# EAGLE design Order#100022604_2Layer_Green_1.6mm_HASL_5cm_x_5cm (EAGLE 6.3)
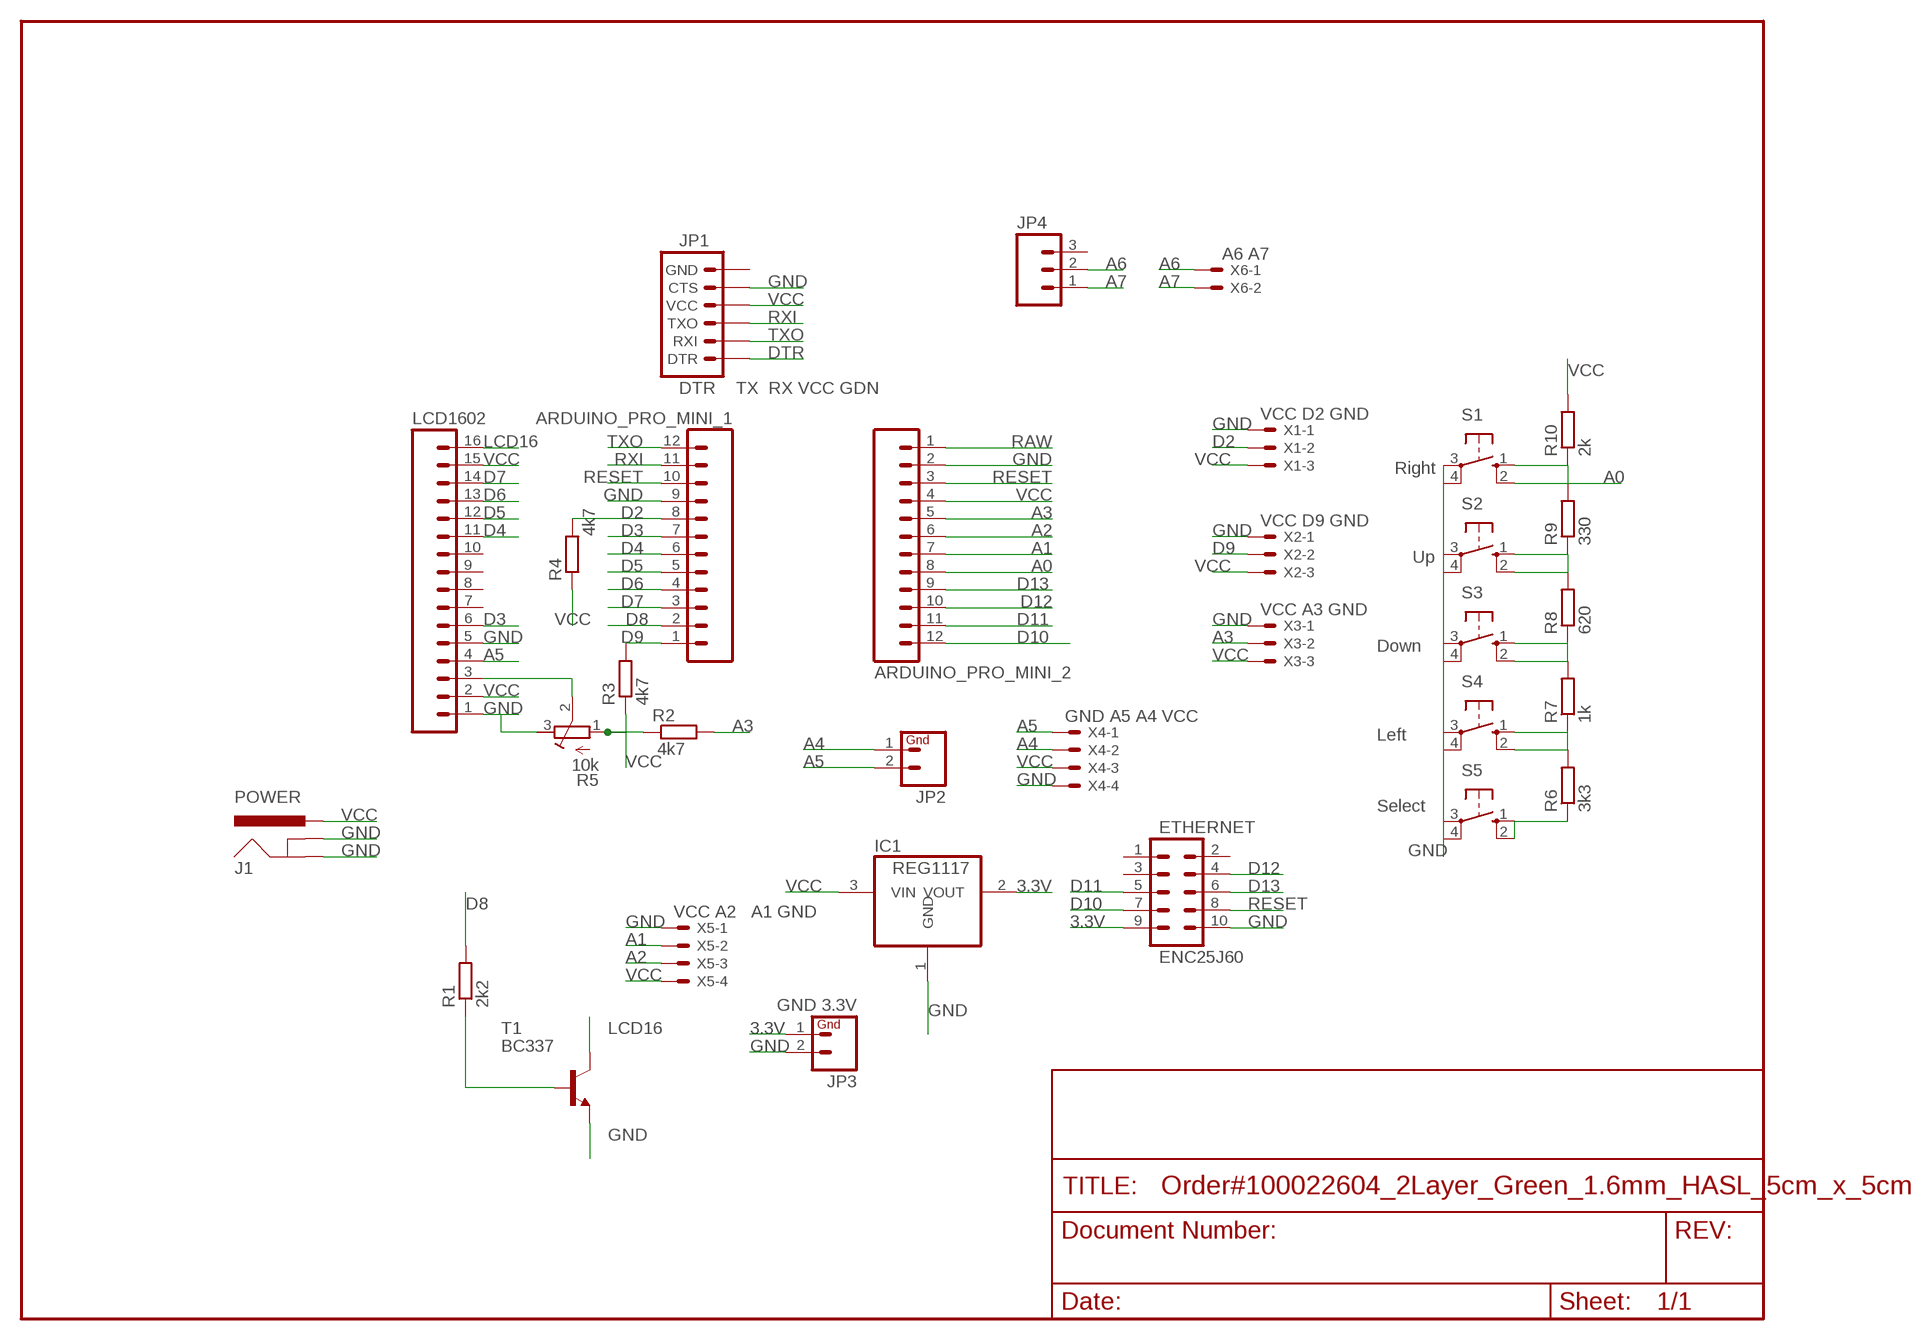
[diagram p0: schematic, sheet 1]

## Parts
ARDUINO_PRO_MINI_1  M12PTH  [1X12]
ARDUINO_PRO_MINI_2  M12PTH  [1X12]
ETHERNET  ENC25J60  M05X2PTH  [AVR_ICSP]
IC1  REG1117  [SOT223]
J1  POWER  POWER_JACKPTH_LOCK  [POWER_JACK_PTH_LOCK]
JP1  DTR TX RX VCC GDN  ARDUINO_SERIAL_PROGRAMPTH  [1X06]
JP2  M02PTH  [1X02]
JP3  GND 3.3V  M02PTH  [1X02]
JP4  M03PTH  [1X03]
LCD1602  HEADER-16P-2.54  [16P-2.54]
R1  2k2  R-EU_0207/10  [0207/10]
R2  4k7  R-EU_0207/10  [0207/10]
R3  4k7  R-EU_0207/10  [0207/10]
R4  4k7  R-EU_0207/10  [0207/10]
R5  10k  R-TRIMM64W  [RTRIM64W]
R6  3k3  R-EU_0207/10  [0207/10]
R7  1k  R-EU_0207/10  [0207/10]
R8  620  R-EU_0207/10  [0207/10]
R9  330  R-EU_0207/10  [0207/10]
R10  2k  R-EU_0207/10  [0207/10]
S1  Right  10-XX  [B3F-10XX]
S2  Up  10-XX  [B3F-10XX]
S3  Down  10-XX  [B3F-10XX]
S4  Left  10-XX  [B3F-10XX]
S5  Select  10-XX  [B3F-10XX]
T1  BC337  [TO92]
X1  VCC D2 GND  22-23-2031  [22-23-2031]
X2  VCC D9 GND  22-23-2031  [22-23-2031]
X3  VCC A3 GND  22-23-2031  [22-23-2031]
X4  GND A5 A4 VCC  22-23-2041  [22-23-2041]
X5  VCC A2 A1 GND  22-23-2041  [22-23-2041]
X6  A6 A7  22-23-2021  [22-23-2021]

## Nets
3.3V: ETHERNET.9 IC1.2(VOUT) JP3.1
A0: ARDUINO_PRO_MINI_2.8 R9.2 R10.1 S1.1(S) S1.2(S1)
A1: ARDUINO_PRO_MINI_2.7 X5.2
A2: ARDUINO_PRO_MINI_2.6 X5.3
A3: ARDUINO_PRO_MINI_2.5 R2.2 X3.2
A4: JP2.1 X4.2
A5: JP2.2 LCD1602.4 X4.1
A6: JP4.2 X6.1
A7: JP4.1 X6.2
D2: ARDUINO_PRO_MINI_1.8 R4.2 X1.2
D3: ARDUINO_PRO_MINI_1.7 LCD1602.6
D4: ARDUINO_PRO_MINI_1.6 LCD1602.11
D5: ARDUINO_PRO_MINI_1.5 LCD1602.12
D6: ARDUINO_PRO_MINI_1.4 LCD1602.13
D7: ARDUINO_PRO_MINI_1.3 LCD1602.14
D8: ARDUINO_PRO_MINI_1.2 R1.2
D9: ARDUINO_PRO_MINI_1.1 R3.2 X2.2
D10: ARDUINO_PRO_MINI_2.12 ETHERNET.7
D11: ARDUINO_PRO_MINI_2.11 ETHERNET.5
D12: ARDUINO_PRO_MINI_2.10 ETHERNET.4
D13: ARDUINO_PRO_MINI_2.9 ETHERNET.6
DTR: JP1.1(DTR)
GND [vcc]: ARDUINO_PRO_MINI_1.9 ARDUINO_PRO_MINI_2.2 ETHERNET.10 IC1.1(GND) J1.GND J1.GNDBREAK JP1.5(CTS) JP3.2 LCD1602.1 LCD1602.5 R5.3(A) S1.3(P) S1.4(P1) S2.3(P) S2.4(P1) S3.3(P) S3.4(P1) S4.3(P) S4.4(P1) S5.3(P) S5.4(P1) T1.1(E) X1.1 X2.1 X3.1 X4.4 X5.1
LCD16: LCD1602.16 T1.3(C)
N$1: LCD1602.3 R5.2(S)
N$4: R1.1 T1.2(B)
N$5: R6.1 S5.1(S) S5.2(S1)
N$6: R6.2 R7.1 S4.1(S) S4.2(S1)
N$8: R7.2 R8.1 S3.1(S) S3.2(S1)
N$11: R8.2 R9.1 S2.1(S) S2.2(S1)
RAW [vcc]: ARDUINO_PRO_MINI_2.1
RESET: ARDUINO_PRO_MINI_1.10 ARDUINO_PRO_MINI_2.3 ETHERNET.8
RXI: ARDUINO_PRO_MINI_1.11 JP1.3(TXO)
TXO: ARDUINO_PRO_MINI_1.12 JP1.2(RXI)
VCC: ARDUINO_PRO_MINI_2.4 IC1.3(VIN) J1.PWR JP1.4(VCC) LCD1602.2 LCD1602.15 R2.1 R3.1 R4.1 R5.1(E) R10.2 X1.3 X2.3 X3.3 X4.3 X5.4
Unconnected: ETHERNET.1 ETHERNET.2 ETHERNET.3 JP1.6(GND) JP4.3 LCD1602.7 LCD1602.8 LCD1602.9 LCD1602.10

## Library data of the parts
ARDUINO_PRO_MINI_1 ARDUINO_PRO_MINI_2 = SparkFun:M12: Header 12 Standard 12-pin 0.1" header. Use with straight break away headers (SKU : PRT-00116), right angle break away headers (PRT-00553), swiss pins (PRT-00743), machine pins (PRT-00117), and female headers (PRT-00115).
ETHERNET = SparkFun-Connectors:M05X2: Header 5x2 Standard 10-pin dual row 0.1" header. Commonly used with AVR-ISP. Use with Spark Fun Electronics SKU: PRT-00778
IC1 = burr-brown:REG1117: 800mA and 1A Low Dropout (LDO) Positive Regulator 1.8V, 2.5V, 2.85V, 3.3V, 5V, and Adj; MPN: REG1117; OC_FARNELL: 1097566; OC_NEWARK: 14P6981
J1 = SparkFun-Connectors:POWER_JACK: Power Jack This is the standard 5.5mm barrel jack for power. The PTH is the most common, proven, reliable, footprint. The Slot footprint only works if the mill layer is transmitted to the PCB fab house so be warned. Spark Fun Electronics SKU : PRT-00119 SMT: CONN-08106 Mating wall wart : TOL-00298 (and others)
JP1 = SparkFun:ARDUINO_SERIAL_PROGRAM
JP2 JP3 = SparkFun:M02: Header 2 Standard 2-pin 0.1" header. Use with straight break away headers (SKU : PRT-00116), right angle break away headers (PRT-00553), swiss pins (PRT-00743), machine pins (PRT-00117), and female headers (PRT-00115). Molex polarized connector foot print use with SKU : PRT-08233 with associated crimp pins and housings.
JP4 = SparkFun-Connectors:M03: Header 3 Standard 3-pin 0.1" header. Use with straight break away headers (SKU : PRT-00116), right angle break away headers (PRT-00553), swiss pins (PRT-00743), machine pins (PRT-00117), and female headers (PRT-00115). Molex polarized connector foot print use with SKU : PRT-08232 with associated crimp pins and housings.
LCD1602 = Connector_seedstudio:HEADER-16P
R1-R4 R6-R10 = resistor:R-EU_: RESISTOR, European symbol
R5 = resistor:R-TRIMM: Trimm resistor
S1-S5 = switch-omron:10-XX: OMRON SWITCH; MPN: B3F-1000; OC_FARNELL: 176432; OC_NEWARK: 36M3542
T1 = transistor:BC337: NPN TRANSISTOR
X1-X3 = con-molex:22-23-2031: .100" (2.54mm) Center Header - 3 Pin; MF: MOLEX; MPN: 22-23-2031; OC_FARNELL: 1462950; OC_NEWARK: 30C0862
X4 X5 = con-molex:22-23-2041: .100" (2.54mm) Center Header - 4 Pin; MF: MOLEX; MPN: 22-23-2041; OC_FARNELL: 1462920; OC_NEWARK: 38C0355
X6 = con-molex:22-23-2021: .100" (2.54mm) Center Header - 2 Pin; MF: MOLEX; MPN: 22-23-2021; OC_FARNELL: 1462926; OC_NEWARK: 25C3832

## Net classes
0 default: width 0.203 mm
1 vcc: width 0.254 mm

## Board
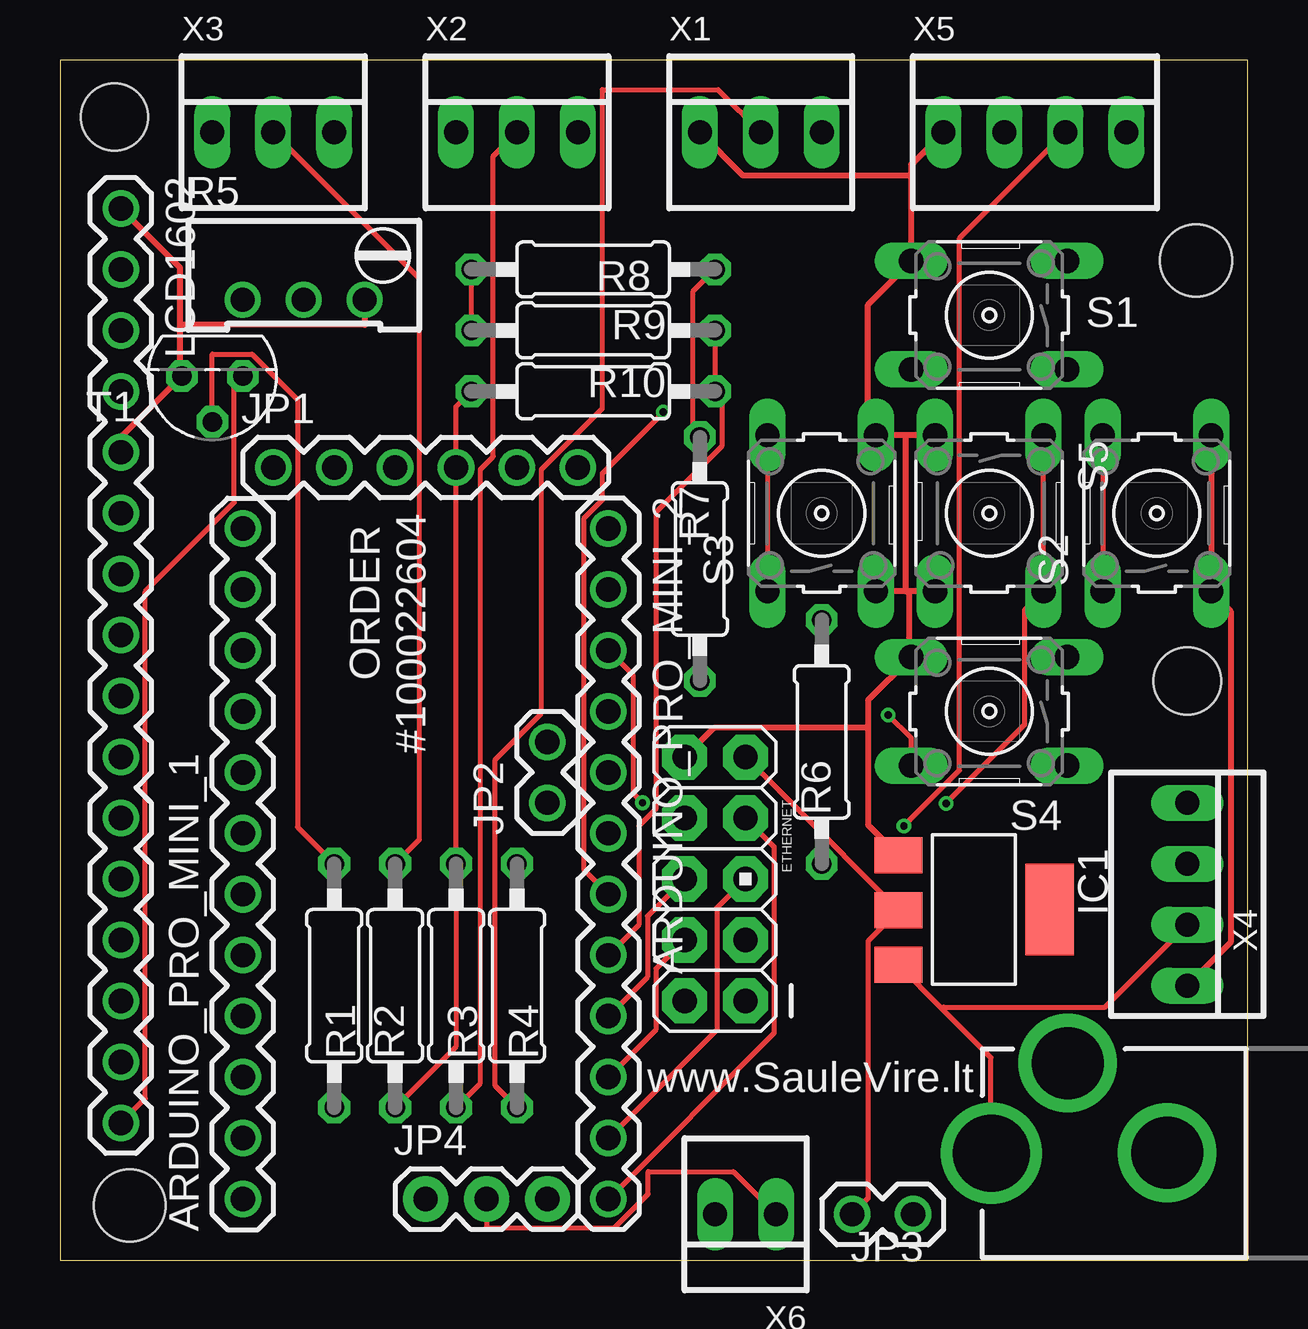
[diagram p1: board, top side]
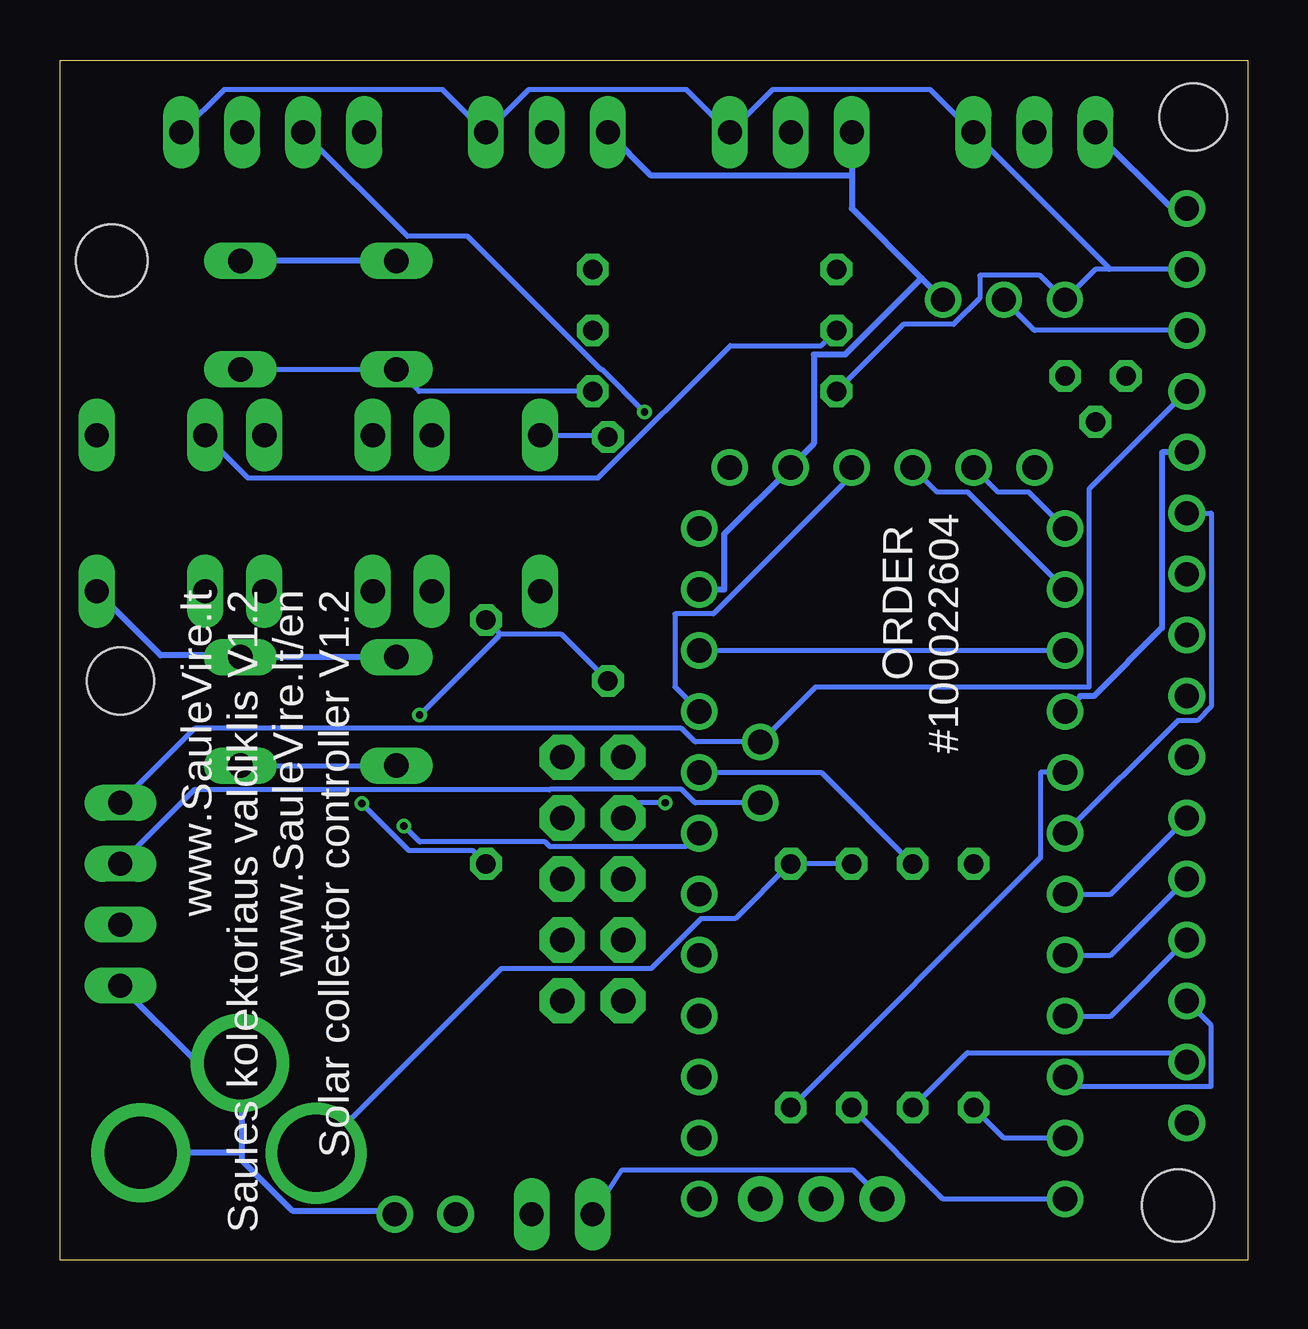
[diagram p2: board, bottom side, seen from below]

Size 49.51 x 50 mm. Coordinates in mm from the lower left corner, seen from the top.
Outline: 0,0 49.51,0 49.51,50 0,50 0,0
Copper layers (1*16): Top 0.035mm / dielectric 1.5mm / Bottom 0.035mm
Design rules "ITEADstudio_DRC": minimum track width 6mil, minimum drill 12mil, track to track 6mil, track to pad 6mil, pad to pad 6mil, via to via 6mil, smd to smd 0mil, copper to edge 10mil, drill to drill 10mil, minimum pad ring 10mil, minimum via ring 6mil, stop-mask expansion 2mil, vias tented up to drill 100mil, thermal gap 10mil
Holes 3 mm at 2.9,2.27 47.35,41.64
Holes 2.8 mm at 2.27,47.62 46.99,24.13

### Footprints (pad centres in the part's own frame; a part is rotated, then mirrored left to right if it is on the bottom)
1X12 = drill 1.016: 1 0,0; 2 2.54,0; 3 5.08,0; 4 7.62,0; 5 10.16,0; 6 12.7,0; 7 15.24,0; 8 17.78,0; 9 20.32,0; 10 22.86,0; 11 25.4,0; 12 27.94,0
AVR_ICSP = drill 1.016 pad 1.88 octagon: 1 -1.27,5.08; 2 1.27,5.08; 3 -1.27,2.54; 4 1.27,2.54; 5 -1.27,0; 6 1.27,0; 7 -1.27,-2.54; 8 1.27,-2.54; 9 -1.27,-5.08; 10 1.27,-5.08
SOT223 = smd 1.499 x 2.007: 1 -2.261,-3.15; 2 0.025,-3.15; 3 2.311,-3.15 | smd 3.81 x 2.007: 4 0,3.15
POWER_JACK_PTH_LOCK = drill 2.997 pad 4.115: GND 0.025,6.557; GNDBREAK 3.762,10.7 | drill 3.2 pad 4.115: PWR 0,13.878
1X06 = drill 1.016: 1 0,0; 2 2.54,0; 3 5.08,0; 4 7.62,0; 5 10.16,0; 6 12.7,0
1X02 = drill 1.016: 1 0,0; 2 2.54,0
1X03 = drill 1.016 pad 1.88: 1 0,0; 2 2.54,0; 3 5.08,0
16P-2.54 = drill 1.016: 1 0,0; 2 2.54,0; 3 5.08,0; 4 7.62,0; 5 10.16,0; 6 12.7,0; 7 15.24,0; 8 17.78,0; 9 20.32,0; 10 22.86,0; 11 25.4,0; 12 27.94,0; 13 30.48,0; 14 33.02,0; 15 35.56,0; 16 38.1,0
0207/10 = drill 0.813 octagon: 1 -5.08,0; 2 5.08,0
RTRIM64W = drill 1: 1 1.27,-2.54; 2 1.27,0; 3 1.27,2.54
B3F-10XX = drill 1.016 long: 1 -3.251,2.261; 2 3.251,2.261; 3 -3.251,-2.261; 4 3.251,-2.261
TO92 = drill 0.813 octagon: 1 1.27,0; 2 0,1.905; 3 -1.27,0
22-23-2031 = drill 1 long: 1 -2.54,0; 2 0,0; 3 2.54,0
22-23-2041 = drill 1 long: 1 -3.81,0; 2 -1.27,0; 3 1.27,0; 4 3.81,0
22-23-2021 = drill 1 long: 1 -1.27,0; 2 1.27,0

### Placement (x,y rotation side)
ARDUINO_PRO_MINI_1  7.62,2.54 90 top
ARDUINO_PRO_MINI_2  22.86,30.48 270 top
ETHERNET  27.3,15.88 180 top
IC1  38.1,14.61 270 top
J1  52.7,4.45 90 top
JP1  8.89,33.02 0 top
JP2  20.32,19.05 90 top
JP3  33.02,1.91 0 top
JP4  15.24,2.54 0 top
LCD1602  2.54,43.81 270 top
R1  11.43,11.43 270 top
R2  13.97,11.43 90 top
R3  16.51,11.43 270 top
R4  19.05,11.43 270 top
R5  10.16,41.27 270 top
R6  31.75,21.59 90 top
R7  26.67,29.21 90 top
R8  22.23,41.27 180 top
R9  22.23,38.73 0 top
R10  22.23,36.2 180 top
S1  38.73,39.37 180 top
S2  45.72,31.11 90 top
S3  31.75,31.11 90 top
S4  38.73,22.86 180 top
S5  38.73,31.11 270 top
T1  6.35,36.83 180 top
X1  29.21,46.99 0 top
X2  19.05,46.99 0 top
X3  8.89,46.99 0 top
X4  46.99,15.24 270 top
X5  40.64,46.99 0 top
X6  28.57,1.91 180 top

### Tracks (layer width: path | path; a pad name or v marks a point on that pad's centre or on a via)
3.3V
  Top 0.203: ETHERNET.9 28.6,20.95 32.66,16.89 32.66,16.87 IC1.2 34.9,14.5 33.68,13.28 33.68,2.56 JP3.1
A0
  Top 0.203: R9.2 R10.1 27.36,36.12 27.58,35.89 27.58,33.91 24.84,31.17 24.84,18.8 24.13,18.09 24.13,13.97 ARDUINO_PRO_MINI_2.8
  Bottom 0.203: S1.1 S1.2 35.41,37.06 34.54,36.2 R10.1
A1  (via drill 0.3)
  Top 0.203: v25.15,35.33 22.61,32.79 22.61,31.67 21.84,30.91 21.84,16.26 ARDUINO_PRO_MINI_2.7
  Bottom 0.203: X5.2 35.03,42.65 32.51,42.65 26.98,37.11 26.92,37.11 v25.15,35.33
A2  (via drill 0.3)
  Top 0.203: X5.3 37.49,42.57 37.49,20.4 v35.18,18.09
  Bottom 0.203: v35.18,18.09 34.52,17.42 29.29,17.42 29.08,17.22 23.42,17.22 ARDUINO_PRO_MINI_2.6
A3
  Top 0.203: X3.2 14.99,40.89 14.99,17.53 R2.2
  Bottom 0.203: R2.2 17.78,20.32 ARDUINO_PRO_MINI_2.5
A4
  Bottom 0.203: X4.2 43.92,19.58 29.11,19.58 29.08,19.61 23.6,19.61 23.04,19.05 JP2.1
A5
  Bottom 0.203: X4.1 43.89,22.15 23.6,22.15 23.04,21.59 JP2.2 20.24,21.64 18.01,23.88 6.6,23.88 6.6,32.13 LCD1602.4
A6
  Top 0.203: X6.1 28.07,3.68 24.51,3.68 24.51,2.74 23.11,1.35 17.78,1.35 JP4.2
A7
  Bottom 0.203: X6.2 26.11,3.73 16.43,3.73 JP4.1
D2
  Top 0.203: X1.2 27.43,48.77 22.61,48.77 22.61,35.48 20.07,32.94 20.07,22.78 18.14,20.85 18.14,7.26 R4.2
  Bottom 0.203: R4.2 8.64,16.76 8.64,20.32 ARDUINO_PRO_MINI_1.8
D3
  Bottom 0.203: ARDUINO_PRO_MINI_1.7 2.92,22.48 2.11,22.48 1.52,23.06 1.52,31.11 LCD1602.6
D4
  Bottom 0.203: LCD1602.11 5.71,15.24 ARDUINO_PRO_MINI_1.6
D5
  Bottom 0.203: LCD1602.12 5.71,12.7 ARDUINO_PRO_MINI_1.5
D6
  Bottom 0.203: LCD1602.13 5.71,10.16 ARDUINO_PRO_MINI_1.4
D7
  Bottom 0.203: LCD1602.14 1.52,9.78 1.52,7.24 7.24,7.24 ARDUINO_PRO_MINI_1.3
D8
  Bottom 0.203: R1.2 10.16,5.08 ARDUINO_PRO_MINI_1.2
D9
  Top 0.203: X2.2 18.06,46 18.06,33.48 17.53,32.94 17.53,7.37 R3.2
  Bottom 0.203: R3.2 12.7,2.54 ARDUINO_PRO_MINI_1.1
D10
  Top 0.203: ARDUINO_PRO_MINI_2.12 29.77,9.45 29.77,17.22 ETHERNET.7
D11
  Top 0.203: ARDUINO_PRO_MINI_2.11 27.38,9.6 27.38,14.68 ETHERNET.5
D12
  Top 0.203: ARDUINO_PRO_MINI_2.10 24.84,9.6 24.84,12.14 ETHERNET.4
D13
  Top 0.203: ARDUINO_PRO_MINI_2.9 24.49,11.79 24.49,14.33 ETHERNET.6
GND
  Top 0.254: LCD1602.5 2.54,34.29 T1.1 5,36.93 5,38.96 | LCD1602.1 5,41.35 5,38.96 | 5,38.96 12.7,38.96 R5.3 | X5.1 35.48,45.64 35.48,45.19 | 35.48,45.19 S1.4 35.41,41.53 33.68,39.8 33.68,34.72 33.93,34.47 S3.4 35.26,34.37 | S2.4 S2.3 48.06,27.76 48.79,27.03 48.79,13.23 X4.4 | S5.3 35.26,34.37 | S5.4 35.41,27.86 | 35.41,27.86 35.26,27.86 | 35.26,27.86 S3.3 | IC1.1 33.68,18.14 33.68,22.17 | 33.68,22.17 33.68,23.32 S4.4 35.41,25.22 35.41,27.86 | ETHERNET.10 27.25,22.17 33.68,22.17 | 35.26,27.86 35.26,34.37 | X1.1 28.47,45.19 35.48,45.19
  Bottom 0.254: X3.1 3.17,43.81 LCD1602.1 | ARDUINO_PRO_MINI_1.9 6.99,23.5 6.43,23.5 3.58,26.34 3.58,33.66 LCD1602.5 | ARDUINO_PRO_MINI_2.2 21.82,27.94 21.82,30.25 JP1.5 18.97,33.12 18.09,34.01 18.09,37.72 16.79,37.72 13.6,40.91 | 13.6,40.91 16.51,43.81 16.51,45.19 | 13.6,40.91 R5.3 | X2.1 16.51,45.19 | X1.1 24.87,45.19 16.51,45.19 | X4.4 43.79,8.23 42.01,8.23 J1.GNDBREAK 41.94,8.1 41.94,4.47 | JP3.2 35.71,2.06 39.83,2.06 41.94,4.17 41.94,4.47 | 41.94,4.47 J1.GND | S1.4 S1.3 | S4.4 S4.3 42.09,25.2 45.31,25.2 S2.3
LCD16
  Top 0.203: T1.3 7.26,36.47 7.26,31.57 3.56,27.86 3.56,6.73 LCD1602.16
N$1
  Bottom 0.203: R5.2 8.89,38.73 LCD1602.3
N$4
  Top 0.203: R1.1 9.91,18.03 9.91,35.84 8,37.74 6.35,37.74 T1.2
N$5  (via drill 0.3)
  Top 0.203: v36.93,19.02 40.21,22.3 40.21,27.08 S5.2 S5.1
  Bottom 0.203: R6.1 32.31,17.07 34.98,17.07 v36.93,19.02
N$6  (via drill 0.3)
  Top 0.203: v34.52,22.71 35.48,21.74 S4.2
  Bottom 0.203: R7.1 28.63,26.09 31.17,26.09 | R6.2 31.17,26.09 | S4.1 S4.2 | v34.52,22.71 31.22,26.01 31.17,26.09
N$8
  Top 0.203: R8.1 26.39,40.36 26.39,34.57 R7.2 | S3.2 S3.1
  Bottom 0.203: R7.2 26.75,34.37 S3.2
N$11
  Top 0.203: R8.2 R9.1 | S2.2 S2.1
  Bottom 0.203: R9.1 17.78,38.1 21.57,38.1 27.08,32.59 41.68,32.59 S2.2
RESET  (via drill 0.3)
  Top 0.203: v24.28,19.05 23.88,19.46 23.88,24.38 ARDUINO_PRO_MINI_2.3
  Bottom 0.203: ARDUINO_PRO_MINI_2.3 ARDUINO_PRO_MINI_1.10 | ETHERNET.8 25.4,19.05 v24.28,19.05
RXI
  Bottom 0.203: ARDUINO_PRO_MINI_1.11 11.68,32 12.95,32 JP1.3
TXO
  Bottom 0.203: ARDUINO_PRO_MINI_1.12 9.14,32 10.41,32 JP1.2
VCC
  Top 0.203: R10.2 16.51,35.56 JP1.4 R3.1 16.51,8.89 R2.1 | 36.77,10.48 38.81,8.43 38.81,4.45 J1.PWR | 36.77,10.48 IC1.3 | X4.3 43.56,10.54 36.83,10.54 36.77,10.48
  Bottom 0.203: LCD1602.2 5.79,41.27 | 5.79,41.27 6.35,41.27 R5.1 7.7,40.06 8.66,41.02 11.18,41.02 11.18,40.08 12.27,38.99 14.35,38.99 R10.2 | 5.79,41.27 5.79,41.35 X3.3 11.51,47.04 13.23,48.77 19.81,48.77 X2.3 21.67,47.04 23.39,48.77 29.97,48.77 X1.3 31.83,47.04 33.55,48.77 42.67,48.77 X5.4 | R3.1 R4.1 19.13,16.46 21.36,14.22 22.78,14.22 24.87,12.14 31.11,12.14 38.81,4.45 J1.PWR | LCD1602.15 2.92,8.64 11.68,8.64 R2.1 | ARDUINO_PRO_MINI_2.4 23.88,23.88 23.88,26.92 22.28,26.92 16.51,32.69 JP1.4

### Text on the board
tPlace: ORDER / #100022604 | www.SauleVire.lt
bPlace: ORDER / #100022604 | www.SauleVire.lt / Saules kolektoriaus valdiklis V1.2 / www.SauleVire.lt/en / Solar collector controller V1.2